# EAGLE design Little-Wire (EAGLE 5.11)
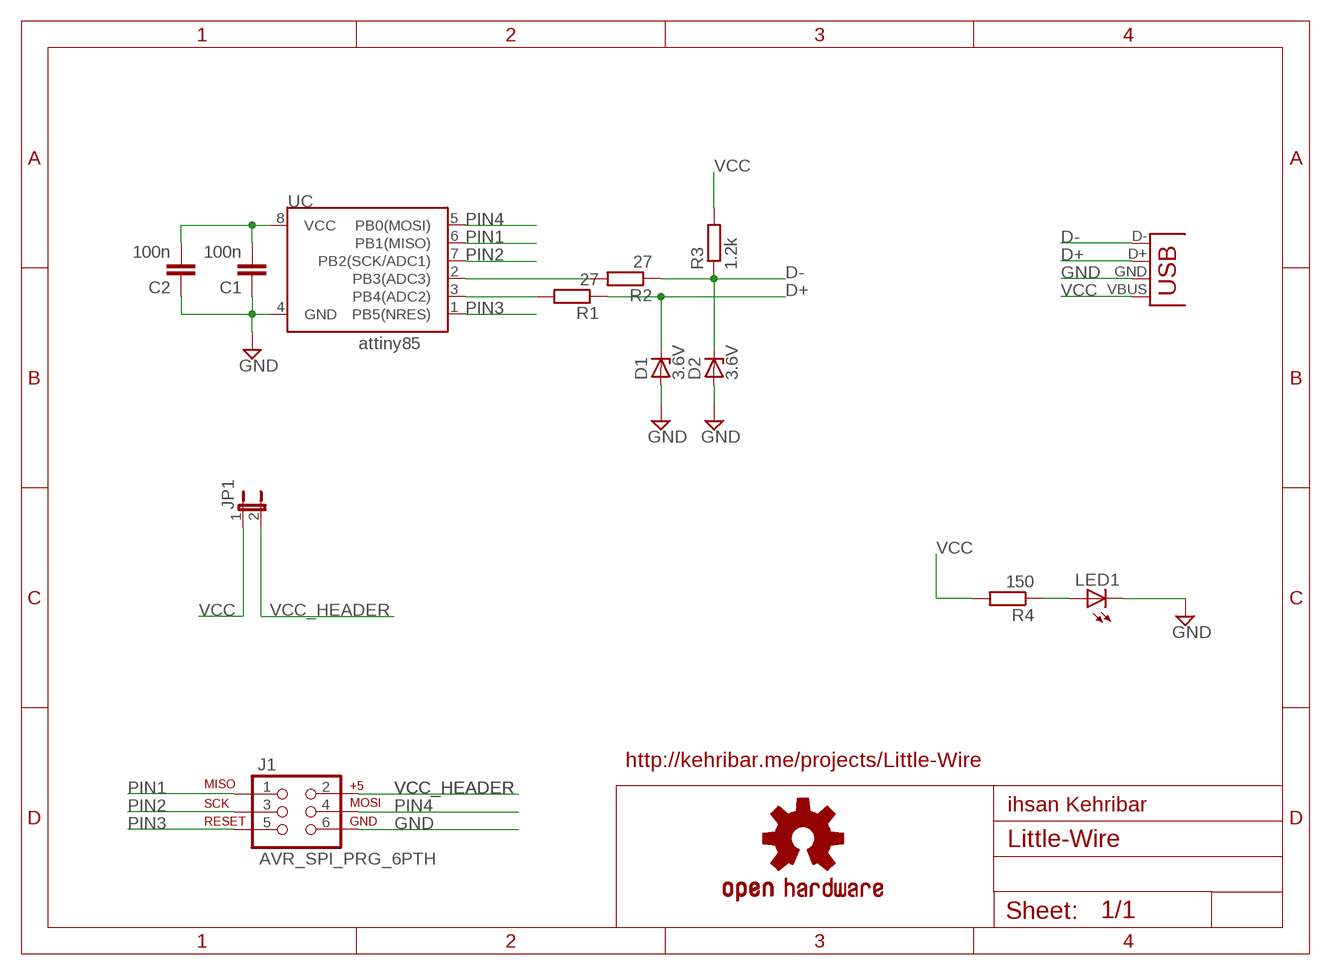
[diagram p0: schematic, sheet 1]

## Parts
C1  100n  C-EU050-025X075  [C050-025X075]
C2  100n  C-EU050-025X075  [C050-025X075]
D1  3.6V  ZENER-DIODEZD-5  [ZDIO-5]
D2  3.6V  ZENER-DIODEZD-5  [ZDIO-5]
J1  AVR_SPI_PRG_6PTH  [2X3]
JP1  JUMPER-2PTH  [1X02]
LED1  LED3MM  [LED3MM]
R1  27  R-EU_0204/5  [0204/5]
R2  27  R-EU_0204/5  [0204/5]
R3  1.2k  R-EU_0204/5  [0204/5]
R4  150  R-EU_0204/5  [0204/5]
U$1  OSHW-LOGOS  [OSHW-LOGO-S]
UC  ATTINY45DIP8  [DIP08]
X1  USB-A-H  [USB-A-H]

## Nets
D+: D1.C R1.1 X1.D+(D-)
D-: D2.C R2.1 R3.1 X1.D-(D+)
GND: C1.1 C2.1 D1.A D2.A J1.6 LED1.K(C) UC.4(GND) X1.GND(VBUS)
N$1: R2.2 UC.2(PB3(ADC3))
N$2: R1.2 UC.3(PB4(ADC2))
N$3: LED1.A R4.1
PIN1: J1.1 UC.6(PB1(MISO))
PIN2: J1.3 UC.7(PB2(SCK/ADC1))
PIN3: J1.5 UC.1(PB5(NRES))
PIN4: J1.4 UC.5(PB0(MOSI))
VCC: C1.2 C2.2 JP1.1 R3.2 R4.2 UC.8(VCC) X1.VBUS(GND)
VCC_HEADER: J1.2 JP1.2

## Notes on the sheet
- attiny85
- http://kehribar.me/projects/Little-Wire
- ihsan Kehribar

## Library data of the parts
C1 C2 = rcl:C-EU: CAPACITOR, European symbol
D1 D2 = diode:ZENER-DIODE: Z-Diode
J1 = SparkFun:AVR_SPI_PRG_6: AVR ISP 6 Pin This is the reduced ISP connector for AVR programming. Common on Arduino. This footprint will take up less PCB space and can be used with a 10-pin to 6-pin adapter such as SKU: BOB-08508
JP1 = SparkFun:JUMPER-2: Jumper Basic 0.1" spaced jumper. Use with breakaway headers.
LED1 = led:LED: LED OSRAM: - CHIPLED LG R971, LG N971, LY N971, LG Q971, LY Q971, LO R971, LY R971 LH N974, LH R974 LS Q976, LO Q976, LY Q976 LO Q996 - Hyper CHIPLED LW Q18S LB Q993, LB Q99A, LB R99A - SideLED LS A670, LO A670, LY A670, LG A670, LP A670 LB A673, LV A673, LT A673, LW A673 LH A674 LY A675 LS A676, LA A676, LO A676, LY A676, LW A676 LS A679, LY A679, LG A679 - Hyper Micro SIDELED® LS Y876, LA Y876, LO Y876, LY Y876 LT Y87S - SmartLED LW L88C, LW L88S LB L89C, LB L89S, LG L890 LS L89K, LO L89K, LY L89K LS L896, LA L896, LO L896, LY L896 - TOPLED LS T670, LO T670, LY T670, LG T670, LP T670 LSG T670, LSP T670, LSY T670, LOP T670, LYG T670 LG T671, LOG T671, LSG T671 LB T673, LV T673, LT T673, LW T673 LH T674 LS T676, LA T676, LO T676, LY T676, LB T676, LH T676, LSB T676, LW T676 LB T67C, LV T67C, LT T67C, LS T67K, LO T67K, LY T67K, LW E67C LS E67B, LA E67B, LO E67B, LY E67B, LB E67C, LV E67C, LT E67C LW T67C LS T679, LY T679, LG T679 LS T770, LO T770, LY T770, LG T770, LP T770 LB T773, LV T773, LT T773, LW T773 LH T774 LS E675, LA E675, LY E675, LS T675 LS T776, LA T776, LO T776, LY T776, LB T776 LHGB T686 LT T68C, LB T68C - Hyper Mini TOPLED® LB M676 - Mini TOPLED Santana® LG M470 LS M47K, LO M47K, LY M47K Source: http://www.osram.convergy.de LUXEON: - LUMILED® LXK2-PW12-R00, LXK2-PW12-S00, LXK2-PW14-U00, LXK2-PW14-V00 LXK2-PM12-R00, LXK2-PM12-S00, LXK2-PM14-U00 LXK2-PE12-Q00, LXK2-PE12-R00, LXK2-PE12-S00, LXK2-PE14-T00, LXK2-PE14-U00 LXK2-PB12-K00, LXK2-PB12-L00, LXK2-PB12-M00, LXK2-PB14-N00, LXK2-PB14-P00, LXK2-PB14-Q00 LXK2-PR12-L00, LXK2-PR12-M00, LXK2-PR14-Q00, LXK2-PR14-R00 LXK2-PD12-Q00, LXK2-PD12-R00, LXK2-PD12-S00 LXK2-PH12-R00, LXK2-PH12-S00 LXK2-PL12-P00, LXK2-PL12-Q00, LXK2-PL12-R00 Source: www.luxeon.com KINGBRIGHT: KA-3528ASYC Source: www.kingbright.com
R1-R4 = rcl:R-EU_: RESISTOR, European symbol
U$1 = SparkFun:OSHW-LOGO: Open Source Hardware Logo This logo indicates the piece of hardware it is found on incorporates a OSHW license and/or adheres to the definition of open source hardware found here: http://freedomdefined.org/OSHW
UC = SparkFun:ATTINY45: Atmel ATTiny45
X1 = SparkFun:USB: USB Connectors USB-B-PTH is fully proven SKU : PRT-00139 USB-miniB is fully proven SKU : PRT-00587 USB-A-PCB is untested. USB-A-H is throughly reviewed, but untested. Spark Fun Electronics SKU : PRT-00437 USB-B-SMT is throughly reviewed, but untested. Needs silkscreen touching up. USB-A-S has not been used/tested USB-MB-H has not been used/tested

## Board
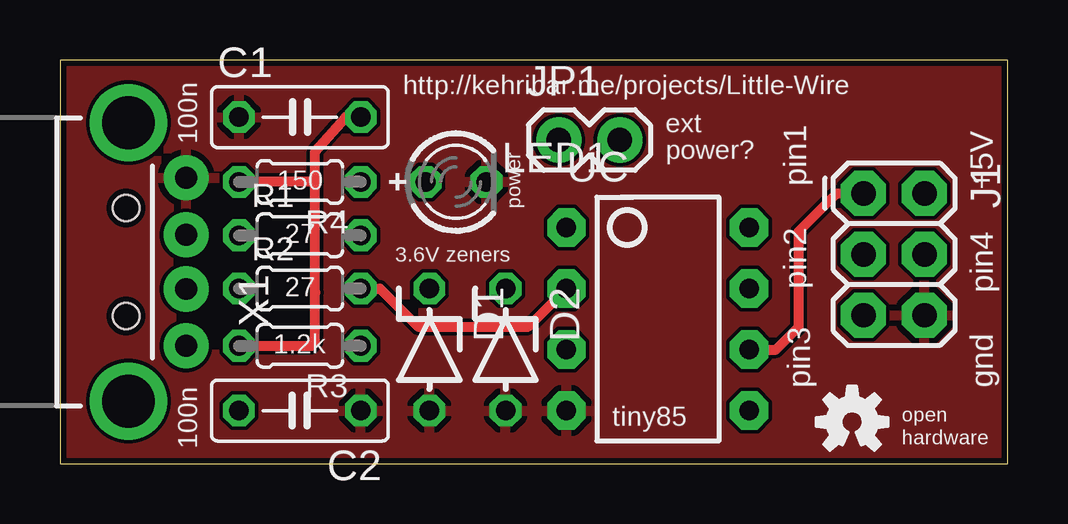
[diagram p1: board, top side]
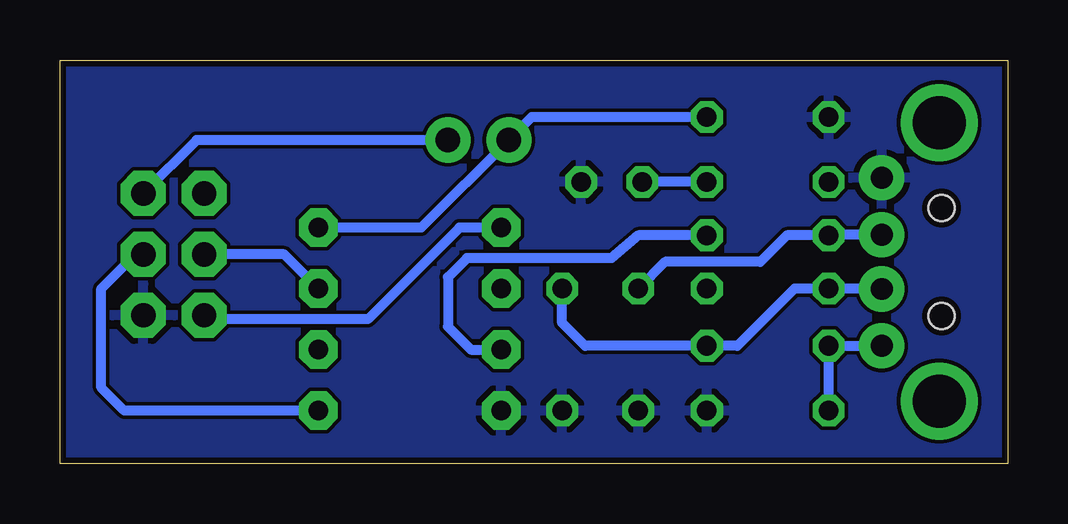
[diagram p2: board, bottom side, seen from below]

Size 39.51 x 16.83 mm. Coordinates in mm from the lower left corner, seen from the top.
Outline: 0,0 39.51,0 39.51,16.82 0,16.83 0,0
Copper layers (1*16): Top 0.035mm / dielectric 1.5mm / Bottom 0.035mm
Design rules "Fusion_eagle_rule_v1.1": minimum track width 6mil, minimum drill 12mil, track to track 6mil, track to pad 6mil, pad to pad 6mil, via to via 6mil, smd to smd 0mil, copper to edge 10mil, drill to drill 10mil, minimum pad ring 10mil, minimum via ring 6mil, stop-mask expansion 2mil, vias tented up to drill 100mil, thermal gap 10mil

### Footprints (pad centres in the part's own frame; a part is rotated, then mirrored left to right if it is on the bottom)
C050-025X075 = drill 0.813 octagon: 1 -2.54,0; 2 2.54,0
ZDIO-5 = drill 0.813 octagon: A 2.54,0; C -2.54,0
2X3 = drill 1.016 pad 1.88 octagon: 1 0,0; 2 0,2.54; 3 2.54,0; 4 2.54,2.54; 5 5.08,0; 6 5.08,2.54
1X02 = drill 1.016 pad 1.88 round: 1 0,0; 2 2.54,0
LED3MM = drill 0.813 octagon: A -1.27,0; K 1.27,0
0204/5 = drill 0.813 octagon: 1 -2.54,0; 2 2.54,0
DIP08 = drill 0.813 pad 1.6 octagon: 1 -3.81,-3.81; 2 -1.27,-3.81; 3 1.27,-3.81; 4 3.81,-3.81; 5 3.81,3.81; 6 1.27,3.81; 7 -1.27,3.81; 8 -3.81,3.81
USB-A-H = drill 0.914 pad 1.88 round: D+ 2.4,1.127; D- 2.4,-1.127; GND 2.4,3.5; VBUS 2.4,-3.5 | drill 2.2 round: GND2 0,-5.8; GND3 0,5.8 | hole 1.1: -0.1,2.25; -0.1,-2.25

### Placement (x,y rotation side)
C1  10,14.45 0 top
C2  10,2.22 180 top
D1  15.4,4.76 270 top
D2  18.57,4.76 270 top
J1  33.5,11.27 270 top
JP1  20.8,13.49 0 top
LED1  16.51,11.75 0 top
R1  10,9.53 0 top
R2  10,7.3 0 top
R3  10,4.92 180 top
R4  10,11.75 180 top
U$1  33.02,1.75 0 top
UC  24.92,6.03 270 top
X1  2.86,8.41 0 top

### Tracks (layer width: path | path; a pad name or v marks a point on that pad's centre or on a via)
D+
  Bottom 0.406: X1.D+ 7.46,9.54 R1.1 9.21,9.53 10.32,8.41 14.29,8.41 D1.C
D-
  Bottom 0.406: X1.D- 7.46,7.29 R2.1 8.89,7.3 11.27,4.92 R3.1 17.62,4.92 18.57,5.87 D2.C
GND
  pour Top: 41.91,18.89 42.07,-2.22 -2.78,-2.22 -2.94,18.97
  pour Bottom: -1.75,-1.11 40.72,-1.11 40.72,17.94 -1.75,17.94
N$1
  Top 0.406: R2.2 13.33,7.3 14.92,5.71 19.53,5.71 UC.2
N$2
  Bottom 0.406: UC.3 22.38,4.76 23.34,5.71 23.34,7.78 22.54,8.57 16.51,8.57 15.4,9.53 R1.2
N$3
  Bottom 0.406: R4.1 14.92,11.75 LED1.A
PIN1
  Top 0.406: UC.6 29.84,4.76 30.8,5.71 30.8,9.68 32.38,11.27 J1.1 | J1.1
PIN2
  Bottom 0.406: UC.7 30.16,8.73 J1.3 | J1.3
PIN3
  Bottom 0.406: UC.1 22.86,9.84 26.67,6.03 32.7,6.03 J1.5
PIN4
  Bottom 0.406: UC.5 36.83,2.22 37.78,3.17 37.78,7.3 36.35,8.73 J1.4
VCC
  Top 0.406: 10.63,5.08 10.63,5.55 | 10.63,5.08 10.64,7.14 10.64,11.75 | 10.64,11.75 10.64,13.02 11.91,14.45 C1.2 | R4.2 8.73,11.75 10.64,11.75 | R3.2 10.47,4.92 10.63,5.08
  Bottom 0.406: X1.VBUS R3.2 C2.2 | C1.2 19.84,14.45 JP1.1 | JP1.1 | JP1.1 24.45,9.84 UC.8 | UC.8
VCC_HEADER
  Bottom 0.406: JP1.2 33.02,13.49 33.81,13.49 J1.2

### Text on the board
_tsilk: http://kehribar.me/projects/Little-Wire | ext | 100n | power? | pin1 | 150 | + | power | +5V | 27 | 3.6V zeners | 27 | pin2 | pin4 | 1.2k | pin3 | gnd | tiny85 | open | 100n | hardware